# Altium schematic sheet [2]-Power Budget.SchDoc
size A4
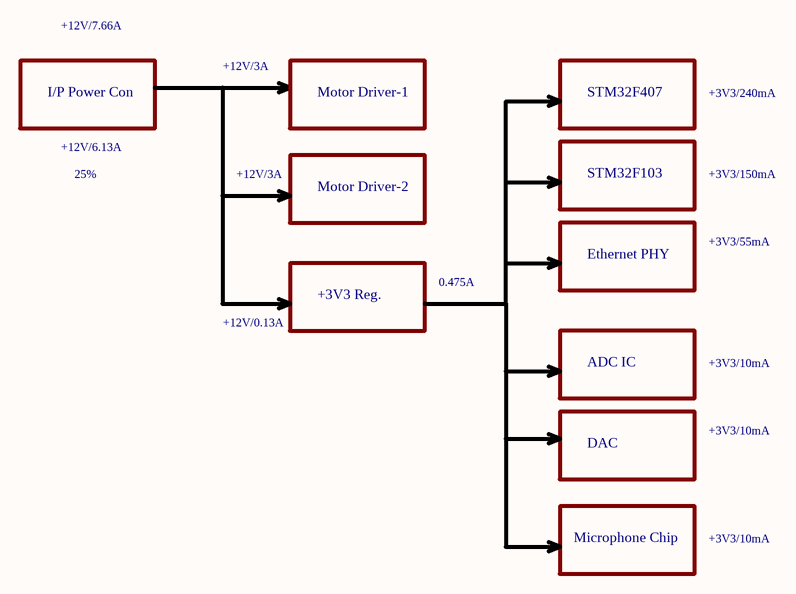
[diagram p0: [2]-Power Budget.SchDoc]

## Notes on the sheet
- +12V/7.66A
- +12V/3A
- I/P Power Con
- +12V/6.13A
- Motor Driver-1
- STM32F407
- +3V3/240mA
- 25%
- Motor Driver-2
- STM32F103
- +3V3/150mA
- 0.475A
- Ethernet PHY
- +3V3/55mA
- +12V/0.13A
- +3V3 Reg.
- ADC IC
- +3V3/10mA
- DAC
- Microphone Chip